# EAGLE schematic rose (EAGLE 7.5.0)

## Sheet 1 of 2
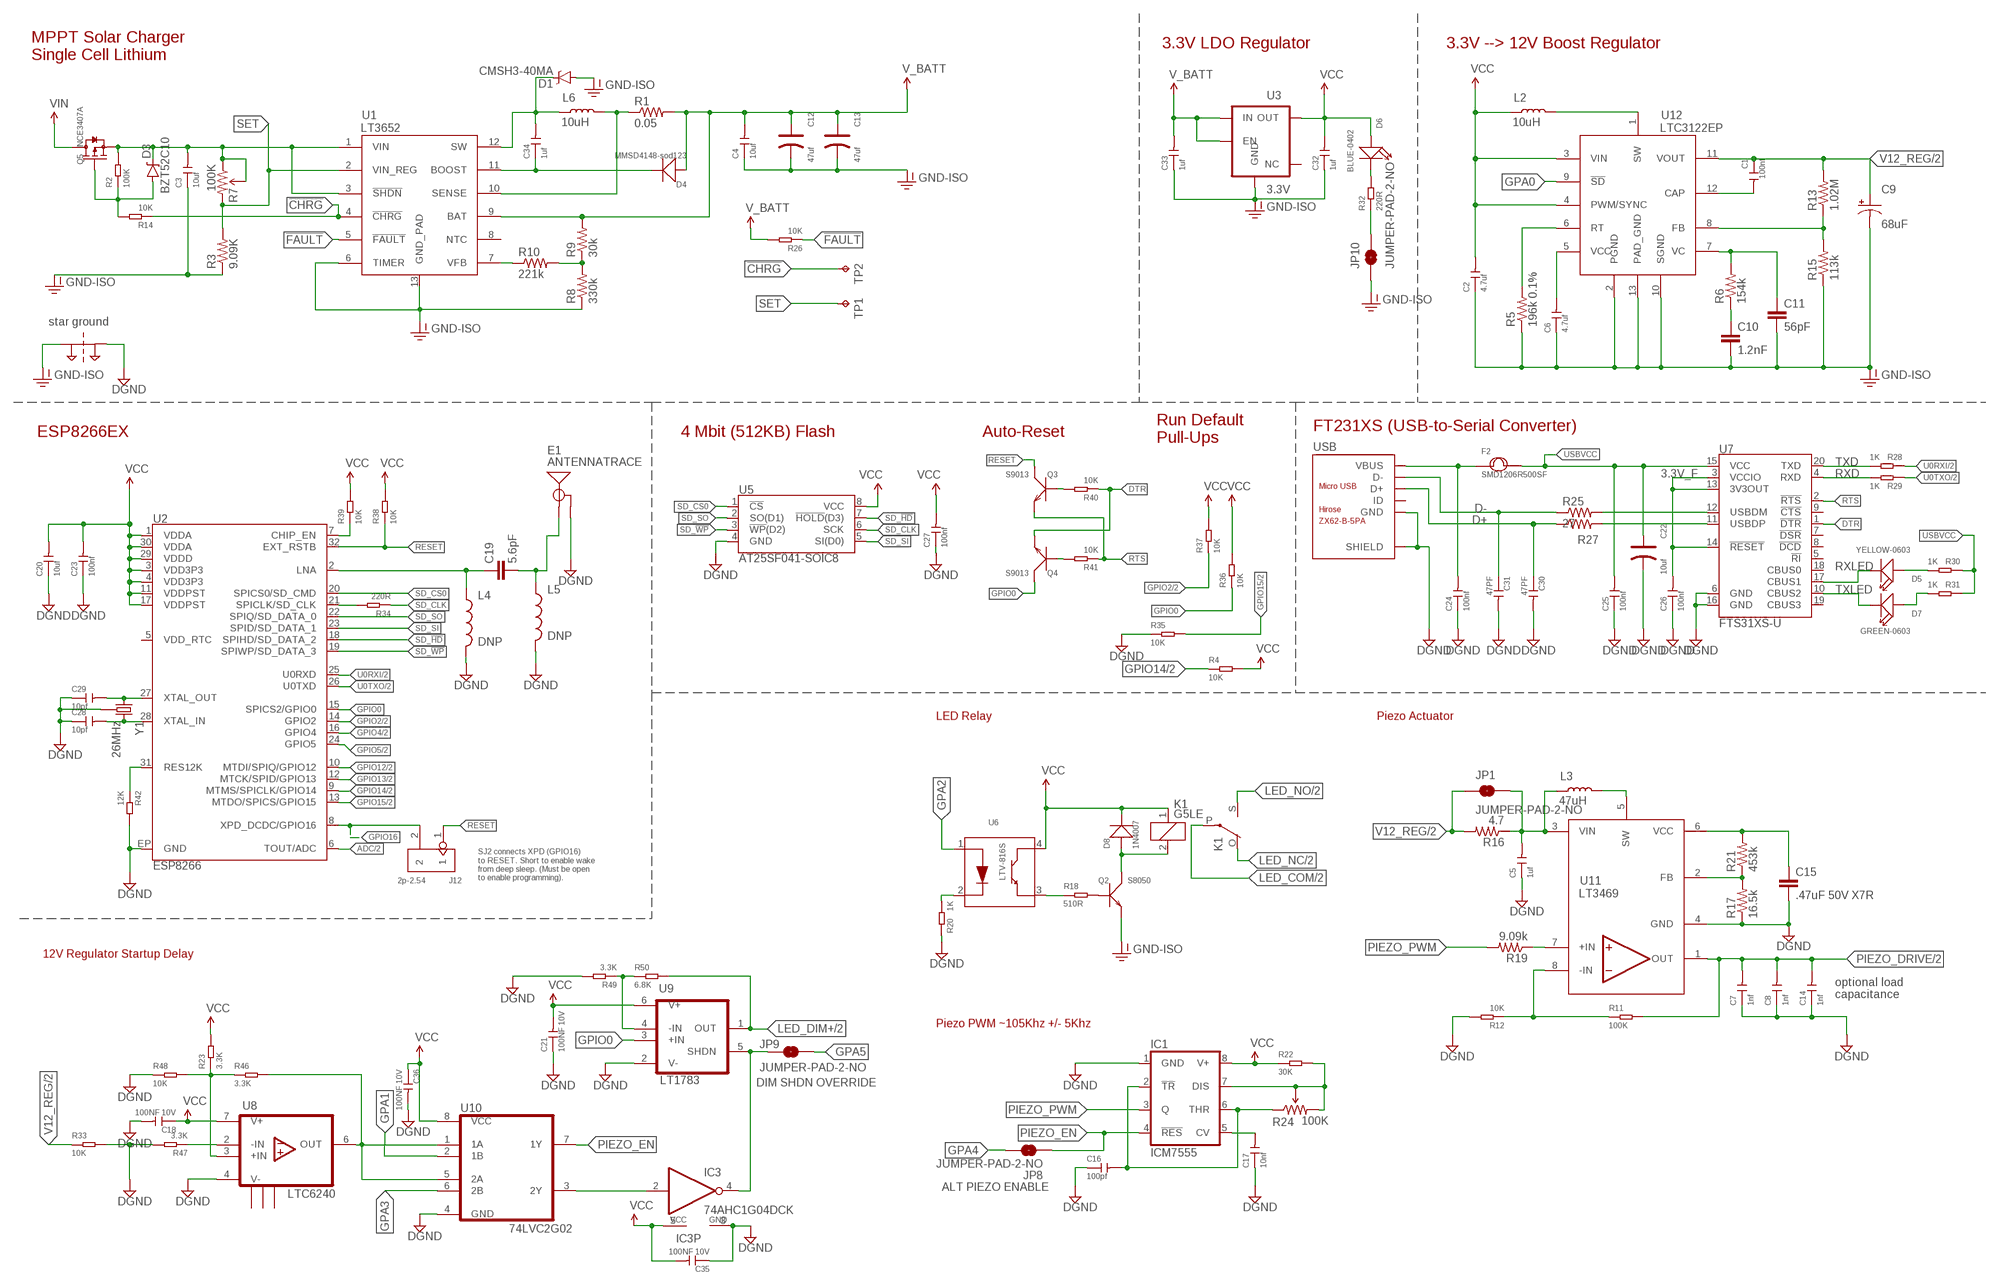
[diagram p0: schematic, sheet 1]

### Parts
C1  100nf  CERAMIC-100NF-25V-10%-X7R(0402)  [C0402]
C2  4.7uf  CERAMIC-4.7UF-10V-10%-X5R(0603)  [C0603]
C3  10uf  CERAMIC-10UF-25V-10%-X5R(0805)  [C0805]
C4  10uf  CERAMIC-10UF-25V-10%-X5R(0805)  [C0805]
C5  1uf  CERAMIC-1UF-25V-10%-X7R(0603)  [C0603]
C6  4.7uf  CERAMIC-4.7UF-10V-10%-X5R(0603)  [C0603]
C7  1nf  CERAMIC-1NF-50V-10%-X7R(0402)  [C0402]
C8  1nf  CERAMIC-1NF-50V-10%-X7R(0402)  [C0402]
C9  68uF  CAP_POL6032  [EIA6032]
C10  1.2nF  CAP0603-CAP  [0603-CAP]
C11  56pF  CAP0603-CAP  [0603-CAP]
C12  47uf  TANTALUM-SMD-47UF-16V(AVX-C)  [AVX-C]
C13  47uf  TANTALUM-SMD-47UF-16V(AVX-C)  [AVX-C]
C14  1nf  CERAMIC-1NF-50V-10%-X7R(0402)  [C0402]
C15  .47uF 50V X7R  CAP0603-CAP  [0603-CAP]
C16  100pf  CERAMIC-100PF-50V-5%-NPO(0603)  [C0603]
C17  10nf  CERAMIC-10NF-50V-10%-X7R(0402)  [C0402]
C18  100NF 10V  CERAMIC 100NF-10V-10%-X5R(0402)  [C0402]
C19  5.6pF  CAP0603-CAP  [0603-CAP]
C20  10uf  CERAMIC-10UF-6.3V-20%-X5R(0402)  [C0402]
C21  100NF 10V  CERAMIC 100NF-10V-10%-X5R(0402)  [C0402]
C22  10uf  TANTALUM-SMD-10UF-10V-10%(AVX-A)  [AVX-A]
C23  100nf  CERAMIC-100NF-25V-10%-X7R(0402)  [C0402]
C24  100nf  CERAMIC-100NF-25V-10%-X7R(0402)  [C0402]
C25  100nf  CERAMIC-100NF-25V-10%-X7R(0402)  [C0402]
C26  100nf  CERAMIC-100NF-25V-10%-X7R(0402)  [C0402]
C27  100nf  CERAMIC-100NF-25V-10%-X7R(0402)  [C0402]
C28  10pf  CERAMIC-10PF-50V-5%-NPO(0402)  [C0402]
C29  10pf  CERAMIC-10PF-50V-5%-NPO(0402)  [C0402]
C30  47PF  CERAMIC-47PF-50V-5%-NP0(0402)  [C0402]
C31  47PF  CERAMIC-47PF-50V-5%-NP0(0402)  [C0402]
C32  1uf  CERAMIC-1UF-25V-10%-X7R(0603)  [C0603]
C33  1uf  CERAMIC-1UF-25V-10%-X7R(0603)  [C0603]
C34  1uf  CERAMIC-1UF-25V-10%-X7R(0603)  [C0603]
C35  100NF 10V  CERAMIC 100NF-10V-10%-X5R(0402)  [C0402]
C36  100NF 10V  CERAMIC 100NF-10V-10%-X5R(0402)  [C0402]
D1  CMSH3-40MA  DIODE-SCHOTTKY-MBRA140  [SMA-DIODE]
D3  BZT52C10  DIODE-ZENER16V  [SOD-123]
D4  MMSD4148-sod123  SMD-DIODE-100V-200MA(SOD-123)  [SOD-123]
D5  YELLOW-0603  SMD-LED-CLEAR-YELLOW(0603)  [LED-0603]
D6  BLUE-0402  SMD-LED-CLEAR-BLUE(0402)  [LED-0402]
D7  GREEN-0603  SMD-LED-CLEAR-GREEN(0603)  [LED-0603]
D8  1N4007  DIODE-GEN-PURPOSE-1KV-1A(DO-214AC)  [DO-214AC]
E1  ANTENNATRACE  [TRACE_ANTENNA_2.4GHZ_25.7MM]
F2  SMD1206R500SF  SMD-PPTC-500MA(1206)  [F1206]
IC1  ICM7555  LM555D  [SO08]
IC3  74AHC1G04DCK  [SC70-5]
J12  2p-2.54  DIP-BLACK-MALE-HEADER-VERT(2P-2.54)  [H2-2.54]
JP1  JUMPER-PAD-2-NO  [PAD-JUMPER-2-NO_NO_SILK]
JP8  JUMPER-PAD-2-NO  [PAD-JUMPER-2-NO_NO_SILK]
JP9  JUMPER-PAD-2-NO  [PAD-JUMPER-2-NO_NO_SILK]
JP10  JUMPER-PAD-2-NO  [PAD-JUMPER-2-NO_NO_SILK]
K1  G5LE  [G5LE]
L2  10uH  SRR1240  [SRR1240]
L3  47uH  SRR1240  [SRR1240]
L4  DNP  INDUCTOR0603  [0603]
L5  DNP  INDUCTOR0603  [0603]
L6  10uH  SRR1240  [SRR1240]
PT1  2PT_GND_TIE  [2PT_GND_TIE]
Q2  S8050  SMD-TRANSISTORS-NPN-25V-500MW-S8050(SOT-23)  [SOT-23]
Q3  S9013  SMD-TRANSISTORS-NPN-25V-500MA-S9013(SOT-23)  [SOT-23]
Q4  S9013  SMD-TRANSISTORS-NPN-25V-500MA-S9013(SOT-23)  [SOT-23]
Q5  NCE3407A  SMD-MOSFET-P-CH-VDC=30V-ID=4.3A-NCE3407A(SOT-23)  [SOT-23]
R1  0.05  RESISTOR1206  [1206]
R2  100K  SMD-RES-100K-1%-1/10W(0603)  [R0603]
R3  9.09K  RESISTOR0603-RES  [0603-RES]
R4  10K  SMD-RES-10K-1%-1/10W(0603)  [R0603]
R5  196k 0.1%  RESISTOR0603-RES  [0603-RES]
R6  154k  RESISTOR0603-RES  [0603-RES]
R7  100K  TRIMPOT-5MMSMD_TRIM_TOP_ADJUST  [ST4ETA]
R8  330k  RESISTOR0603-RES  [0603-RES]
R9  30k  RESISTOR0603-RES  [0603-RES]
R10  221k  RESISTOR0603-RES  [0603-RES]
R11  100K  SMD-RES-100K-1%-1/10W(0603)  [R0603]
R12  10K  SMD-RES-10K-1%-1/10W(0603)  [R0603]
R13  1.02M  RESISTOR0603-RES  [0603-RES]
R14  10K  SMD-RES-10K-1%-1/10W(0603)  [R0603]
R15  113k  RESISTOR0603-RES  [0603-RES]
R16  4.7  RESISTOR0603-RES  [0603-RES]
R17  16.5k  RESISTOR0603-RES  [0603-RES]
R18  510R  SMD-RES-510R-5%-1/10W(0603)  [R0603]
R19  9.09k  RESISTOR0603-RES  [0603-RES]
R20  1K  SMD-RES-1K-1%-1/10W(0603)  [R0603]
R21  453k  RESISTOR0603-RES  [0603-RES]
R22  30K  SMD-RES-30K-1%-1/10W(0603)  [R0603]
R23  3.3K  SMD-RES-3.3K-1%-1/10W(0603)  [R0603]
R24  100K  TRIMPOT-5MMSMD_TRIM_TOP_ADJUST  [ST4ETA]
R25  27  27OHM1/10W1%(0603)0603-RES  [0603-RES]
R26  10K  SMD-RES-10K-1%-1/10W(0603)  [R0603]
R27  27  27OHM1/10W1%(0603)0603-RES  [0603-RES]
R28  1K  SMD-RES-1K-1%-1/10W(0603)  [R0603]
R29  1K  SMD-RES-1K-1%-1/10W(0603)  [R0603]
R30  1K  SMD-RES-1K-1%-1/10W(0603)  [R0603]
R31  1K  SMD-RES-1K-1%-1/10W(0603)  [R0603]
R32  220R  SMD-RES-220R-5%-1/10W(0603)  [R0603]
R33  10K  SMD-RES-10K-1%-1/10W(0603)  [R0603]
R34  220R  SMD-RES-220R-5%-1/10W(0603)  [R0603]
R35  10K  SMD-RES-10K-1%-1/10W(0603)  [R0603]
R36  10K  SMD-RES-10K-1%-1/10W(0603)  [R0603]
R37  10K  SMD-RES-10K-1%-1/10W(0603)  [R0603]
R38  10K  SMD-RES-10K-1%-1/10W(0603)  [R0603]
R39  10K  SMD-RES-10K-1%-1/10W(0603)  [R0603]
R40  10K  SMD-RES-10K-1%-1/10W(0603)  [R0603]
R41  10K  SMD-RES-10K-1%-1/10W(0603)  [R0603]
R42  12K  SMD-RES-12K-1%-1/10W(0603)  [R0603]
R46  3.3K  SMD-RES-3.3K-1%-1/10W(0603)  [R0603]
R47  3.3K  SMD-RES-3.3K-1%-1/10W(0603)  [R0603]
R48  10K  SMD-RES-10K-1%-1/10W(0603)  [R0603]
R49  3.3K  SMD-RES-3.3K-1%-1/10W(0603)  [R0603]
R50  6.8K  SMD-RES-6.8K-1%-1/10W(0603)  [R0603]
TP1  TPTP10SQ  [TP10SQ]
TP2  TPTP10SQ  [TP10SQ]
U1  LT3652  [MSOP-12_GND]
U2  ESP8266  [QFN32]
U3  3.3V  V_REG_AP2112K-3.3V  [SOT23-5]
U5  AT25SF041-SOIC8  [SO08]
U6  LTV-816S  SMD-PHOTOCOUPLER-5KV-LTV-816S(4P-4.6X6.5MM)  [SMD4-2.54-4.6X6.5MM]
U7  FTS31XS-U  FT231XS  [SSOP20_L]
U8  LTC6240  [SOIC-8]
U9  LT1783  [TSOT-23-6]
U10  74LVC2G02  [TSSOP-8]
U11  LT3469  [TSOT-23-8]
U12  LTC3122EP  [12MSOP]
USB  ZX62-B-5PA  MICRO-USB-SMD(ZX62-B-5PA)  [MICRO-USB5+6P-SMD-0.65-AB]
Y1  26MHz  CRYSTAL-GROUNDED3.2X2.5  [CRYSTAL-SMD-3.2X2.5]

### Nets
3.3V_F: C26.2 U7.3(VCCIO) U7.13(3V3OUT) U7.14(!RESET)
!CHRG: R14.1 TP2.TP U1.4(!CHRG)
!FAULT: R26.1 U1.5(!FAULT)
ADC: U2.6(TOUT/ADC) ; also sheet 2
BOOST: C34.1 D4.- U1.11(BOOST)
CHIP_EN: R39.1 U2.7(CHIP_EN)
D+: C30.1 R27.1 USB.3(D+)
D-: C31.1 R25.1 USB.2(D-)
DGND: C5.1 C7.1 C8.1 C14.1 C15.2 C16.1 C17.1 C18.2 C20.1 C21.1 C22.- C23.1 C24.1 C25.1 C26.1 C27.1 C28.1 C29.1 C30.2 C31.2 C35.1 C36.2 E1.GND E1.GND2(GND) IC1.1(GND) IC3.3(GND) L4.2 L5.2 PT1.P$2 R12.2 R17.1 R20.2 R33.2 R35.1 R42.2 R47.2 R48.1 R49.2 U2.EP(GND) U5.4(GND) U7.6(GND) U7.16(GND) U8.4(V-) U9.2(V-) U10.4(GND) U11.4(GND) USB.5(GND) USB.P1(SHIELD) USB.P2(SHIELD) USB.P3(SHIELD) USB.P4(SHIELD) USB.P5(SHIELD) USB.P6(SHIELD) Y1.2(GND) Y1.4(GND) ; also sheet 2
DTR: Q4.2(E) R40.1 U7.1(!DTR)
FB: R8.2 R9.1 R10.2
GND-ISO: C2.1 C3.1 C4.1 C6.1 C9.P$2(-) C10.2 C11.2 C12.- C13.- C32.1 C33.1 D1.A JP10.1 PT1.P$1 Q2.2(E) R3.1 R5.1 R8.1 R15.1 U1.6(TIMER) U1.13(GND_PAD) U3.2(GND) U12.2(PGND) U12.10(SGND) U12.13(PAD_GND) ; also sheet 2
GPA0: U12.9(!SD) ; also sheet 2
GPA1: U10.2(1B) ; also sheet 2
GPA2: U6.1(ANODE) ; also sheet 2
GPA3: U10.6(2B) ; also sheet 2
GPA4: JP8.1 ; also sheet 2
GPA5: JP9.1 ; also sheet 2
GPIO0: Q4.3(C) R36.1 U2.15(SPICS2/GPIO0) U9.3(+IN)
GPIO2: R37.1 U2.14(GPIO2) ; also sheet 2
GPIO4: U2.16(GPIO4) ; also sheet 2
GPIO5: U2.24(GPIO5) ; also sheet 2
GPIO12: U2.10(MTDI/SPIQ/GPIO12) ; also sheet 2
GPIO13: U2.12(MTCK/SPID/GPIO13) ; also sheet 2
GPIO14: R4.1 U2.9(MTMS/SPICLK/GPIO14) ; also sheet 2
GPIO15: R35.2 U2.13(MTDO/SPICS/GPIO15) ; also sheet 2
GPIO16: J12.2 U2.8(XPD_DCDC/GPIO16)
LED_COM: K1.P(2:P) ; also sheet 2
LED_DIM+: R50.2 U9.1(OUT) ; also sheet 2
LED_NC: K1.O(2:O) ; also sheet 2
LED_NO: K1.S(2:S) ; also sheet 2
LNA: C19.1 L4.1 U2.2(LNA)
LNA2: C19.2 E1.ANT(SIGNAL) L5.1
N$1: R42.1 U2.31(RES12K)
N$2: C3.2 D3.C Q5.2(S) R2.2 R7.P$1(CCW) R7.P$2(WIPER) U1.1(VIN) U1.3(!SHDN)
N$3: R10.1 U1.7(VFB)
N$5: R20.1 U6.2(CATHODE)
N$6: D3.A Q5.1(G) R2.1 R14.2
N$7: IC1.7(DIS) R22.2 R24.P$2(WIPER) R24.P$3(CW)
N$8: C28.2 U2.28(XTAL_IN) Y1.3
N$9: D8.1(+) K1.2 Q2.3(C)
N$12: C16.2 IC1.2(!TR) IC1.6(THR) R24.P$1(CCW)
N$13: R18.1 U6.3(EMITER)
N$14: C17.2 IC1.5(CV)
N$15: Q2.1(B) R18.2
N$16: C29.2 U2.27(XTAL_OUT) Y1.1
N$17: L2.P$2 U12.1(SW)
N$18: R5.2 U12.6(RT)
N$19: C6.2 U12.5(VCC)
N$20: R46.2 U8.6(OUT) U10.1(1A) U10.5(2A)
N$21: C1.2 U12.12(CAP)
N$22: C11.1 R6.2 U12.7(VC)
N$23: R13.1 R15.2 U12.8(FB)
N$24: C10.1 R6.1
N$25: L3.P$2 U11.5(SW)
N$26: C5.2 JP1.2 L3.P$1 R16.1 U11.3(VIN)
N$27: R11.1 R12.1 U11.8(-IN)
N$29: R19.1 U11.7(+IN)
N$30: C15.1 R21.2 U11.6(VCC)
N$31: R17.2 R21.1 U11.2(FB)
N$32: D7.+ R31.1
N$33: D5.+ R30.1
N$34: R25.2 U7.12(USBDM)
N$35: R27.2 U7.11(USBDP)
N$36: D6.- R32.2
N$37: JP10.2 R32.1
N$38: Q3.1(B) R40.2
N$39: Q4.1(B) R41.2
N$59: R23.1 R46.1 R48.2 U8.3(+IN)
N$60: R47.1 U8.2(-IN)
N$64: R49.1 R50.1 U9.4(-IN)
N$65: IC3.2(I) U10.3(2Y)
N$67: IC3.4(O) JP9.2 U9.5(SHDN)
PIEZO_DRIVE: C7.2 C8.2 C14.2 R11.2 U11.1(OUT) ; also sheet 2
PIEZO_EN: IC1.4(!RES) JP8.2 U10.7(1Y)
PIEZO_PWM: IC1.3(Q) R19.2
RESET: J12.1 Q3.3(C) R38.1 U2.32(EXT_RSTB)
RTS: Q3.2(E) R41.1 U7.2(!RTS)
RXD: R29.1 U7.4(RXD)
RXLED: D5.- U7.17(CBUS1)
SD_!HD!: U2.18(SPIHD/SD_DATA_2) U5.7(!HOLD!(D3))
SD_!WP!: U2.19(SPIWP/SD_DATA_3) U5.3(!WP!(D2))
SD_CLK: R34.1 U5.6(SCK)
SD_CLK0: R34.2 U2.21(SPICLK/SD_CLK)
SD_CS0: U2.20(SPICS0/SD_CMD) U5.1(!CS!)
SD_SI: U2.23(SPID/SD_DATA_1) U5.5(SI(D0))
SD_SO: U2.22(SPIQ/SD_DATA_0) U5.2(SO(D1))
SENSE: L6.P$2 R1.1 U1.10(SENSE)
SET: R3.2 R7.P$3(CW) TP1.TP U1.2(VIN_REG)
SW: C34.2 D1.C L6.P$1 U1.12(SW)
TXD: R28.1 U7.20(TXD)
TXLED: D7.- U7.10(CBUS2)
U0RXI: R28.2 U2.25(U0RXD) ; also sheet 2
U0TXO: R29.2 U2.26(U0TXD) ; also sheet 2
USBVCC: C22.+ C25.2 F2.2 R30.2 R31.2 U7.15(VCC)
V12_REG: C1.1 C9.P$1(+) JP1.1 R13.2 R16.2 R33.1 U12.11(VOUT) ; also sheet 2
V_BATT: C4.2 C12.+ C13.+ C33.2 D4.+ R1.2 R9.2 R26.2 U1.9(BAT) U3.1(IN) U3.3(EN) ; also sheet 2
VBUS: C24.2 F2.1 USB.1(VBUS)
VCC: C2.2 C18.1 C20.2 C21.2 C23.2 C27.2 C32.2 C35.2 C36.1 D6.+ D8.2(-) IC1.8(V+) IC3.5(VCC) K1.1 L2.P$1 R4.2 R22.1 R23.2 R36.2 R37.2 R38.2 R39.2 U2.1(VDDA) U2.3(VDD3P3) U2.4(VDD3P3) U2.11(VDDPST) U2.17(VDDPST) U2.29(VDDD) U2.30(VDDA) U3.5(OUT) U5.8(VCC) U6.4(COLLECTOR) U8.7(V+) U9.6(V+) U10.8(VCC) U12.3(VIN) U12.4(PWM/SYNC) ; also sheet 2
VIN: Q5.3(D) ; also sheet 2
Unconnected: U1.8(NTC) U2.5(VDD_RTC) U3.4(NC) U7.5(!RI) U7.7(!DSR) U7.8(!DCD) U7.9(!CTS) U7.18(CBUS0) U7.19(CBUS3) U8.1(NC1) U8.5(NC5) U8.8(NC8) USB.4(ID)

### Notes on the sheet
- 3.3V LDO Regulator | 3.3V --> 12V Boost Regulator
- MPPT Solar Charger
  Single Cell Lithium
- star ground
- FT231XS (USB-to-Serial Converter)
- 4 Mbit (512KB) Flash | Auto-Reset
- Run Default
  Pull-Ups
- ESP8266EX
- LED Relay | Piezo Actuator
- SJ2 connects XPD (GPIO16) 
  to RESET. Short to enable wake 
  from deep sleep. (Must be open
  to enable programming).
- 12V Regulator Startup Delay
- optional load
  capacitance
- Piezo PWM ~105Khz +/- 5Khz
- DIM SHDN OVERRIDE
- ALT PIEZO ENABLE

## Sheet 2 of 2
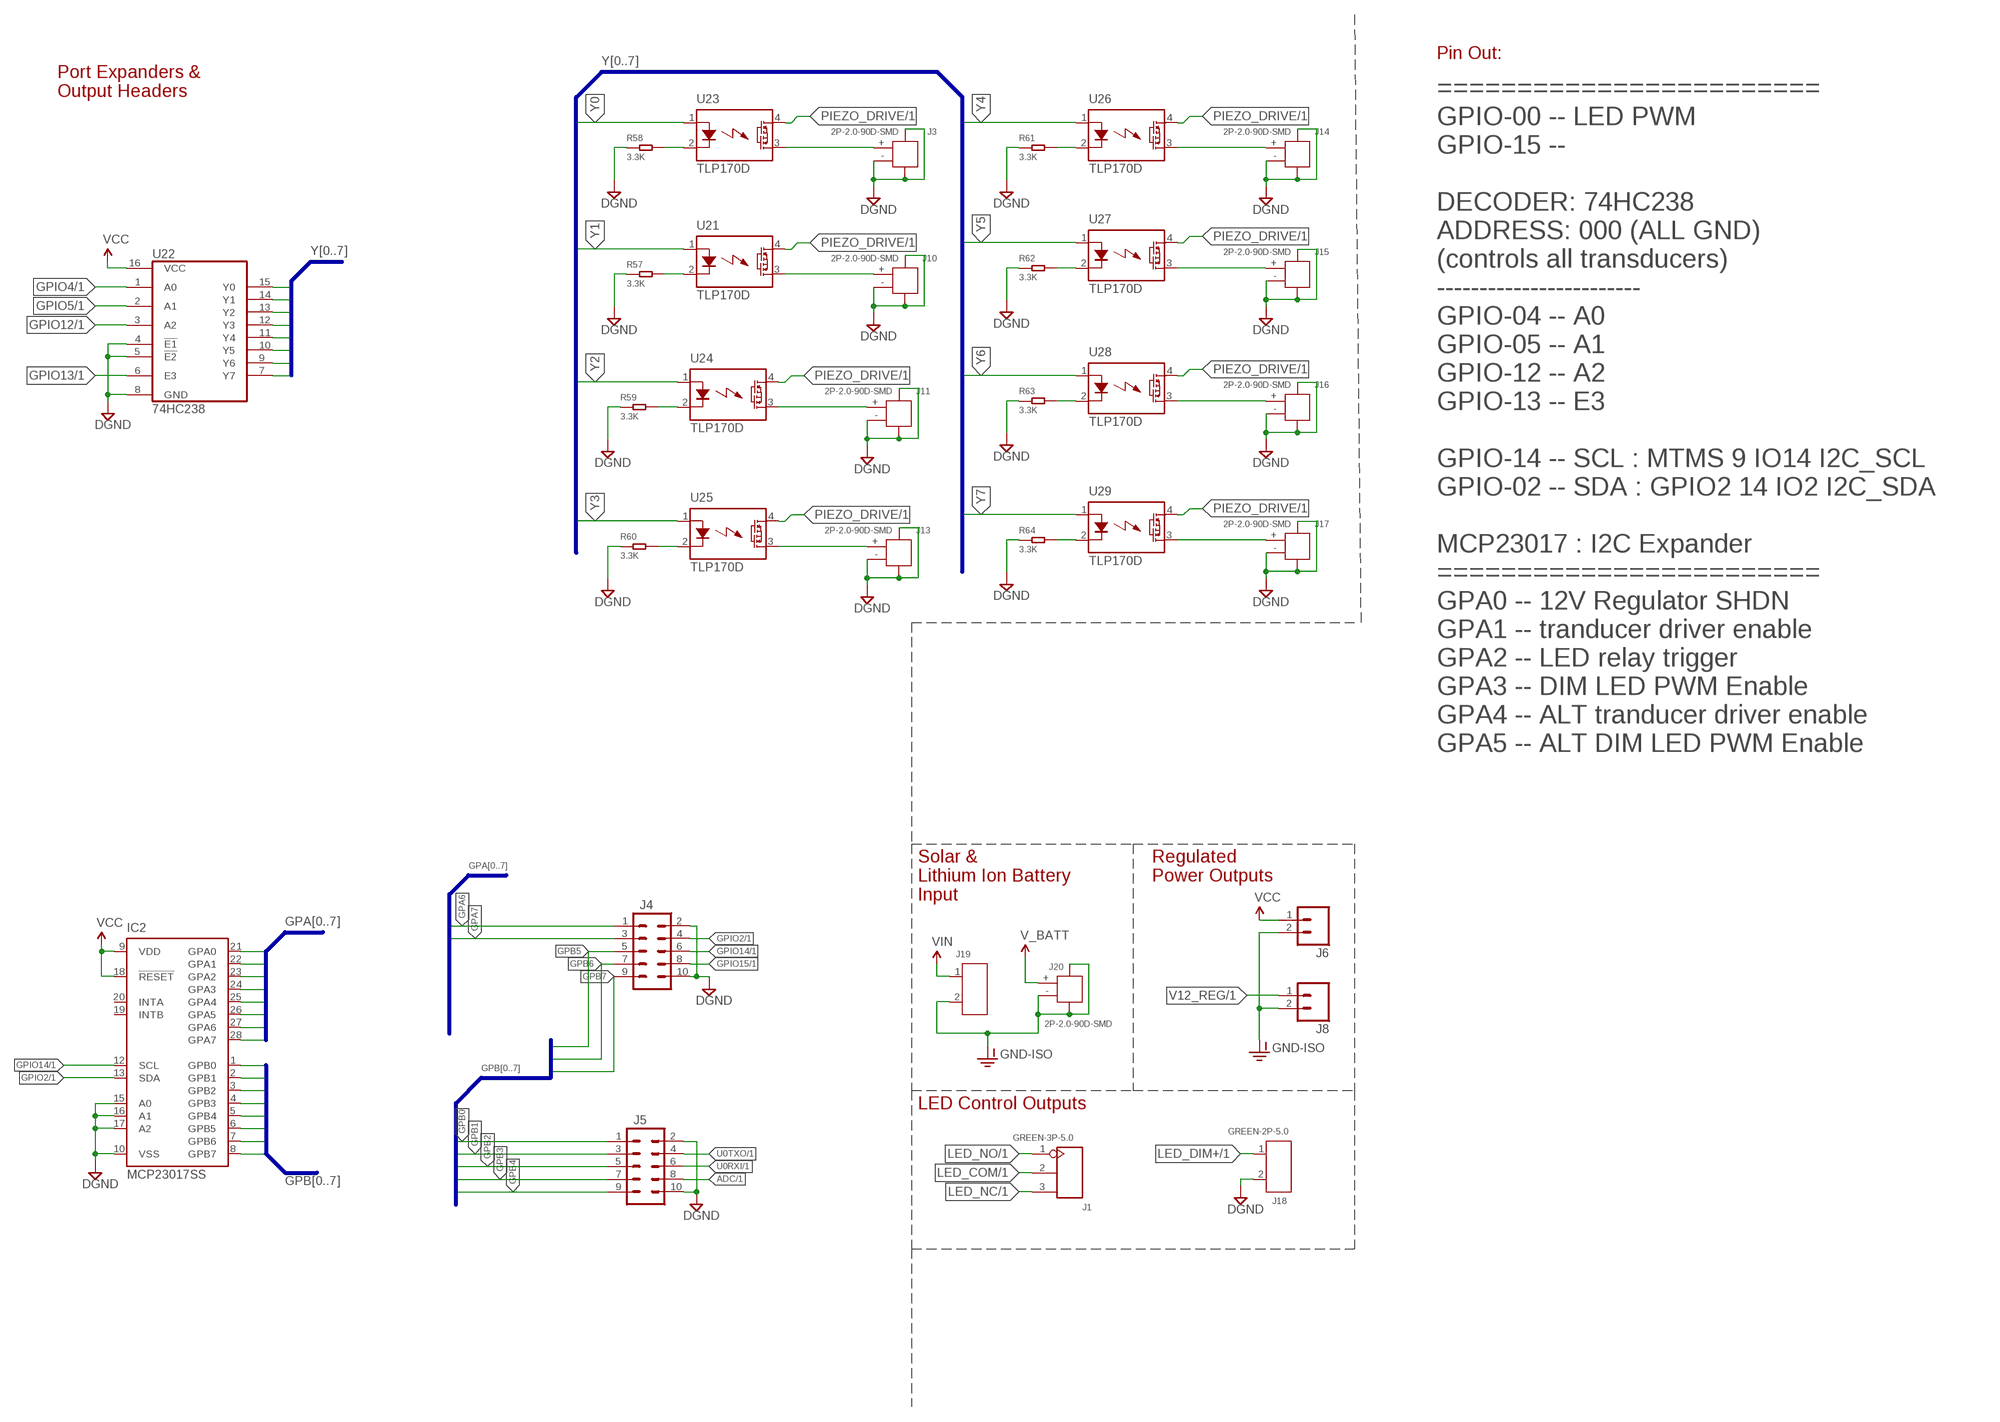
[diagram p1: schematic, sheet 2]

### Parts
IC2  MCP23017SS  [SSOP28]
J1  GREEN-3P-5.0  SCREW-TERMINAL-GREEN(3P-5.0)  [H3-5.0-15.5X8.0MM]
J3  2P-2.0-90D-SMD  CONN-HEADER-SMD-PH-SIDE-(2P-2.0MM)  [HW2-SMD-2.0-90D]
J4  M05X2NO_SILK  [2X5_NOSILK]
J5  M05X2NO_SILK  [2X5_NOSILK]
J6  M02PTH  [1X02]
J8  M02PTH  [1X02]
J10  2P-2.0-90D-SMD  CONN-HEADER-SMD-PH-SIDE-(2P-2.0MM)  [HW2-SMD-2.0-90D]
J11  2P-2.0-90D-SMD  CONN-HEADER-SMD-PH-SIDE-(2P-2.0MM)  [HW2-SMD-2.0-90D]
J13  2P-2.0-90D-SMD  CONN-HEADER-SMD-PH-SIDE-(2P-2.0MM)  [HW2-SMD-2.0-90D]
J14  2P-2.0-90D-SMD  CONN-HEADER-SMD-PH-SIDE-(2P-2.0MM)  [HW2-SMD-2.0-90D]
J15  2P-2.0-90D-SMD  CONN-HEADER-SMD-PH-SIDE-(2P-2.0MM)  [HW2-SMD-2.0-90D]
J16  2P-2.0-90D-SMD  CONN-HEADER-SMD-PH-SIDE-(2P-2.0MM)  [HW2-SMD-2.0-90D]
J17  2P-2.0-90D-SMD  CONN-HEADER-SMD-PH-SIDE-(2P-2.0MM)  [HW2-SMD-2.0-90D]
J18  GREEN-2P-5.0  SCREW-TERMINAL-GREEN(2P-5.0)  [H2-5.0-10.5X8.0MM]
J19  GREEN-2P-5.0  SCREW-TERMINAL-GREEN(2P-5.0)  [H2-5.0-10.5X8.0MM]
J20  2P-2.0-90D-SMD  CONN-HEADER-SMD-PH-SIDE-(2P-2.0MM)  [HW2-SMD-2.0-90D]
R57  3.3K  SMD-RES-3.3K-1%-1/10W(0603)  [R0603]
R58  3.3K  SMD-RES-3.3K-1%-1/10W(0603)  [R0603]
R59  3.3K  SMD-RES-3.3K-1%-1/10W(0603)  [R0603]
R60  3.3K  SMD-RES-3.3K-1%-1/10W(0603)  [R0603]
R61  3.3K  SMD-RES-3.3K-1%-1/10W(0603)  [R0603]
R62  3.3K  SMD-RES-3.3K-1%-1/10W(0603)  [R0603]
R63  3.3K  SMD-RES-3.3K-1%-1/10W(0603)  [R0603]
R64  3.3K  SMD-RES-3.3K-1%-1/10W(0603)  [R0603]
U21  TLP170D  [4-SOP]
U22  74HC238  [TSSOP-16]
U23  TLP170D  [4-SOP]
U24  TLP170D  [4-SOP]
U25  TLP170D  [4-SOP]
U26  TLP170D  [4-SOP]
U27  TLP170D  [4-SOP]
U28  TLP170D  [4-SOP]
U29  TLP170D  [4-SOP]

### Nets
ADC: J5.8 ; also sheet 1
DGND: IC2.10(VSS) IC2.15(A0) IC2.16(A1) IC2.17(A2) J3.3 J3.4 J3.- J4.2 J4.10 J5.2 J5.10 J10.3 J10.4 J10.- J11.3 J11.4 J11.- J13.3 J13.4 J13.- J14.3 J14.4 J14.- J15.3 J15.4 J15.- J16.3 J16.4 J16.- J17.3 J17.4 J17.- J18.2 R57.1 R58.1 R59.1 R60.1 R61.1 R62.1 R63.1 R64.1 U22.4(!E1) U22.5(!E2) U22.8(GND) ; also sheet 1
GND-ISO: J6.2 J8.2 J19.2 J20.3 J20.4 J20.- ; also sheet 1
GPA0: IC2.21(GPA0) ; also sheet 1
GPA1: IC2.22(GPA1) ; also sheet 1
GPA2: IC2.23(GPA2) ; also sheet 1
GPA3: IC2.24(GPA3) ; also sheet 1
GPA4: IC2.25(GPA4) ; also sheet 1
GPA5: IC2.26(GPA5) ; also sheet 1
GPA6: IC2.27(GPA6) J4.1
GPA7: IC2.28(GPA7) J4.3
GPB0: IC2.1(GPB0) J5.1
GPB1: IC2.2(GPB1) J5.3
GPB2: IC2.3(GPB2) J5.5
GPB3: IC2.4(GPB3) J5.7
GPB4: IC2.5(GPB4) J5.9
GPB5: IC2.6(GPB5) J4.5
GPB6: IC2.7(GPB6) J4.7
GPB7: IC2.8(GPB7) J4.9
GPIO2: IC2.13(SDA) J4.4 ; also sheet 1
GPIO4: U22.1(A0) ; also sheet 1
GPIO5: U22.2(A1) ; also sheet 1
GPIO12: U22.3(A2) ; also sheet 1
GPIO13: U22.6(E3) ; also sheet 1
GPIO14: IC2.12(SCL) J4.6 ; also sheet 1
GPIO15: J4.8 ; also sheet 1
LED_COM: J1.2 ; also sheet 1
LED_DIM+: J18.1 ; also sheet 1
LED_NC: J1.3 ; also sheet 1
LED_NO: J1.1 ; also sheet 1
N$10: J10.+ U21.3(DS2)
N$43: R57.2 U21.2(K)
N$45: J11.+ U24.3(DS2)
N$46: R59.2 U24.2(K)
N$47: J3.+ U23.3(DS2)
N$48: R58.2 U23.2(K)
N$49: J13.+ U25.3(DS2)
N$50: R60.2 U25.2(K)
N$51: J14.+ U26.3(DS2)
N$52: R61.2 U26.2(K)
N$53: J15.+ U27.3(DS2)
N$54: R62.2 U27.2(K)
N$55: J16.+ U28.3(DS2)
N$56: R63.2 U28.2(K)
N$57: J17.+ U29.3(DS2)
N$58: R64.2 U29.2(K)
PIEZO_DRIVE: U21.4(DS1) U23.4(DS1) U24.4(DS1) U25.4(DS1) U26.4(DS1) U27.4(DS1) U28.4(DS1) U29.4(DS1) ; also sheet 1
U0RXI: J5.6 ; also sheet 1
U0TXO: J5.4 ; also sheet 1
V12_REG: J8.1 ; also sheet 1
V_BATT: J20.+ ; also sheet 1
VCC: IC2.9(VDD) IC2.18(!RESET) J6.1 U22.16(VCC) ; also sheet 1
VIN: J19.1 ; also sheet 1
Y0: U22.15(Y0) U23.1(A)
Y1: U21.1(A) U22.14(Y1)
Y2: U22.13(Y2) U24.1(A)
Y3: U22.12(Y3) U25.1(A)
Y4: U22.11(Y4) U26.1(A)
Y5: U22.10(Y5) U27.1(A)
Y6: U22.9(Y6) U28.1(A)
Y7: U22.7(Y7) U29.1(A)
Unconnected: IC2.19(INTB) IC2.20(INTA)

### Buses
GPA[0..7]
GPB[0..7]
Y[0..7]

### Notes on the sheet
- Pin Out:
- Port Expanders & 
  Output Headers
- ========================
  GPIO-00 -- LED PWM
  GPIO-15 -- 
  
  DECODER: 74HC238 
  ADDRESS: 000 (ALL GND)
  (controls all transducers)
  ------------------------
  GPIO-04 -- A0
  GPIO-05 -- A1
  GPIO-12 -- A2
  GPIO-13 -- E3 
  
  GPIO-14 -- SCL : MTMS 9 IO14 I2C_SCL
  GPIO-02 -- SDA : GPIO2 14 IO2 I2C_SDA
  
  MCP23017 : I2C Expander
  ========================
  GPA0 -- 12V Regulator SHDN
  GPA1 -- tranducer driver enable
  GPA2 -- LED relay trigger
  GPA3 -- DIM LED PWM Enable
  GPA4 -- ALT tranducer driver enable
  GPA5 -- ALT DIM LED PWM Enable
- Regulated
  Power Outputs
- Solar & 
  Lithium Ion Battery 
  Input
- LED Control Outputs

## Library data of the parts
C1 C23-C27 = Seeed-OPL-Capacitor:CERAMIC-100NF-25V-10%-X7R(0402): 302010024; MPN: CC0402KRX7R8BB104
C2 C6 = Seeed-OPL-Capacitor:CERAMIC-4.7UF-10V-10%-X5R(0603): 302010111; MPN: CC0603KRX5R6BB475
C3 C4 = Seeed-OPL-Capacitor:CERAMIC-10UF-25V-10%-X5R(0805): 302010178; MPN: CC0805KKX5R8BB106
C5 C32-C34 = Seeed-OPL-Capacitor:CERAMIC-1UF-25V-10%-X7R(0603): 302010139; MPN: CC0603KRX7R8BB105
C7 C8 C14 = Seeed-OPL-Capacitor:CERAMIC-1NF-50V-10%-X7R(0402): 302010005; MPN: CC0402KRX7R9BB102
C9 = SparkFun-Capacitors:CAP_POL: Capacitor Polarized These are standard SMD and PTH capacitors. Normally 10uF, 47uF, and 100uF in electrolytic and tantalum varieties. Always verify the external diameter of the through hole cap, it varies with capacity, voltage, and manufacturer. The EIA devices should be standard.
C10 C11 C15 = SparkFun-Capacitors:CAP: Capacitor Standard 0603 ceramic capacitor, and 0.1" leaded capacitor.
C12 C13 = Seeed-OPL-Capacitor:TANTALUM-SMD-47UF-16V(AVX-C): 302020022
C16 = Seeed-OPL-Capacitor:CERAMIC-100PF-50V-5%-NPO(0603): 302010076
C17 = Seeed-OPL-Capacitor:CERAMIC-10NF-50V-10%-X7R(0402): 302010006; MPN: CC0402KRX7R9BB103
C18 C21 C35 C36 = Seeed-OPL-Capacitor:CERAMIC 100NF-10V-10%-X5R(0402): 302010037; MPN: CC0402KRX5R6BB104
C19 = SparkFun-Capacitors:CAP: Capacitor Standard 0603 ceramic capacitor, and 0.1" leaded capacitor.; PROD_ID: CAP-12456
C20 = Seeed-OPL-Capacitor:CERAMIC-10UF-6.3V-20%-X5R(0402): 302010053; MPN: CC0402MRX5R5BB106
C22 = Seeed-OPL-Capacitor:TANTALUM-SMD-10UF-10V-10%(AVX-A): 302020011; MPN: TAJA106K010RNJ
C28 C29 = Seeed-OPL-Capacitor:CERAMIC-10PF-50V-5%-NPO(0402): 302010001
C30 C31 = Seeed-OPL-Capacitor:CERAMIC-47PF-50V-5%-NP0(0402): 302010007
D1 = SparkFun-DiscreteSemi:DIODE-SCHOTTKY: Schottky diodes in SFE's production catalog BAT20J 1A 23V 0.62Vf RB751 120mA 40V 0.37Vf PMEG4005EJ 0.5A 40V 0.42Vf MBRA140 1A 40V 0.5Vf B340A 3A 40V SMA; PROD_ID: DIO-08053; VALUE: MBRA140
D3 = SparkFun-DiscreteSemi:DIODE-ZENER: Zener Diode Production Part - 8199 3.4V Zener Voltage; PROD_ID: DIO-12440; VALUE: 16V
D4 = Seeed-OPL-Diode:SMD-DIODE-100V-200MA(SOD-123): 304010007; MPN: MMSD4148
D5 = Seeed-OPL-Diode:SMD-LED-CLEAR-YELLOW(0603): 304090044; MPN: 19-217-Y5C-AM1N1VY-3T
D6 = Seeed-OPL-Diode:SMD-LED-CLEAR-BLUE(0402): 304090075; MPN: BL-HB337A-AV-TRB
D7 = Seeed-OPL-Diode:SMD-LED-CLEAR-GREEN(0603): 304090043; MPN: 19-217-G7C-AN1P2-3T
D8 = Seeed-OPL-Diode:DIODE-GEN-PURPOSE-1KV-1A(DO-214AC): 304010013; MPN: 1N4007
E1 = SparkFun-RF:ANTENNA: Chip antenna Chip antenna with ground or secondary connection. Common with larger metal RF connectors.
F2 = Seeed-OPL-fuse:SMD-PPTC-500MA(1206): 307010002; MPN: SMD1206R500SF
IC1 = adafruit:*555: TIMER Changed DIP package to have round (not oval) pin pads http://www.ladyada.net/library/pcb/eaglelibrary.html
IC2 = adafruit:MCP23017: http://ww1.microchip.com/downloads/en/DeviceDoc/21952a.pdf Source: http://ww1.microchip.com/downloads/en/DeviceDoc/21952a.pdf
IC3 = 74xx-little-us:74*1G04: INVERTER Gate
J1 = Seeed-OPL-Connector:SCREW-TERMINAL-GREEN(3P-5.0): 320110029
J3 J10 J11 J13-J17 J20 = Seeed-OPL-Connector:CONN-HEADER-SMD-PH-SIDE-(2P-2.0MM): 320110026
J4 J5 = SparkFun-Connectors:M05X2: Header 5x2 Standard 10-pin dual row 0.1" header. Commonly used with AVR-ISP. Use with Spark Fun Electronics SKU: PRT-00778
J6 J8 = SparkFun-Connectors:M02: Standard 2-pin 0.1" header. Use with - straight break away headers ( PRT-00116) - right angle break away headers (PRT-00553) - swiss pins (PRT-00743) - machine pins (PRT-00117) - female headers (PRT-00115) Molex polarized connector foot print use with: PRT-08233 with associated crimp pins and housings. 2.54_SCREWTERM for use with PRT-10571. 3.5mm Screw Terminal footprints for PRT-08084 5mm Screw Terminal footprints for use with PRT-08432
J12 = Seeed-OPL-Connector:DIP-BLACK-MALE-HEADER-VERT(2P-2.54): 320020016; MPN: P125-1102A0BS116A1
J18 J19 = Seeed-OPL-Connector:SCREW-TERMINAL-GREEN(2P-5.0): 320110031
JP1 JP8-JP10 = SparkFun-Passives:JUMPER-PAD-2-NO
K1 = relay:G5LE: RELAY 1 x switch, 10 A/120 V AC, 8 A/30 V DC, Omron; OC_FARNELL: unknown; OC_NEWARK: unknown
L2 L3 L6 = OkOkOkEagleLibraries:SRR1240: SRR1240 Series - Shielded SMD Power Inductors DATASHEET: http://www.bourns.com/docs/Product-Datasheets/SRR1240.pdf; MPN: SRR1240-470M
L4 L5 = SparkFun-Passives:INDUCTOR: Inductors Basic Inductor/Choke - 0603 and 1206. Footprints are not proven and vary greatly between part numbers. INDUCTOR POWER 3.3UH 4.0A SMD 0.197" L x 0.197" W x 0.177" H (5.00mm x 5.00mm x 4.50mm)
PT1 = SparkFun-Passives:2PT_GND_TIE: Package for connecting two ground nets in one place.
Q2 = Seeed-OPL-Transistor:SMD-TRANSISTORS-NPN-25V-500MW-S8050(SOT-23): 305010017; MPN: S8050
Q3 Q4 = Seeed-OPL-Transistor:SMD-TRANSISTORS-NPN-25V-500MA-S9013(SOT-23): 305010018; MPN: S9013
Q5 = Seeed-OPL-Transistor:SMD-MOSFET-P-CH-VDC=30V-ID=4.3A-NCE3407A(SOT-23): 305030010; MPN: NCE3407A
R1 R3 R5 R6 R8-R10 R13 R15-R17 R19 R21 = SparkFun-Resistors:RESISTOR: Resistor Basic schematic elements and footprints for 0603, 1206, and PTH resistors.
R2 R11 = Seeed-OPL-Resistor:SMD-RES-100K-1%-1/10W(0603): 301010196; MPN: RC0603FR-07100KL
R4 R12 R14 R26 R33 R35-R41 R48 = Seeed-OPL-Resistor:SMD-RES-10K-1%-1/10W(0603): 301010299; MPN: RC0603FR-0710KL
R7 R24 = OkOkOkEagleLibraries:TRIMPOT-5MM: Copal 5MM Trimpot (top adjust) ST4-EA foot print http://www.nidec-copal-electronics.com/e/product/files/file/65e3e77c541ac3708ffab78898d80fdd53dcbd6a.pdf; MPN: ST4ETA104
R18 = Seeed-OPL-Resistor:SMD-RES-510R-5%-1/10W(0603): 301010157; MPN: RC0603JR-07510RL
R20 R28-R31 = Seeed-OPL-Resistor:SMD-RES-1K-1%-1/10W(0603): 301010298; MPN: RC0603FR-071KL
R22 = Seeed-OPL-Resistor:SMD-RES-30K-1%-1/10W(0603): 301010202; MPN: RC0603FR-0730KL
R23 R46 R47 R49 R57-R64 = Seeed-OPL-Resistor:SMD-RES-3.3K-1%-1/10W(0603): 301010251; MPN: RC0603FR-073K3L
R25 R27 = SparkFun-Resistors:27OHM1/10W1%(0603): RES-09334; PROD_ID: RES-09334
R32 R34 = Seeed-OPL-Resistor:SMD-RES-220R-5%-1/10W(0603): 301010163; MPN: RC0603JR-07220RL
R42 = Seeed-OPL-Resistor:SMD-RES-12K-1%-1/10W(0603): 301010102; MPN: RC0603FR-0712KL
R50 = Seeed-OPL-Resistor:SMD-RES-6.8K-1%-1/10W(0603): 301010198; MPN: RC0805JR-07220KL
TP1 TP2 = testpad:TP: Test pad
U1 = SparkFun-PowerIC:LT3652: LT3652 MPPT Solar Charge Controller 5V-32V smart charger for batteries up to 14.4V
U2 = esp8266-development-board:ESP8266: Espressif ESP8266 WiFi Smart Connectivity Platform.; PROD_ID: IC-12452
U3 = SparkFun-PowerIC:V_REG_AP2112: AP2112 - 600mA CMOS LDO Regulator w/ Enable The AP2112 is CMOS process low dropout linear regulator with enable function, the regulator delivers a guaranteed 600mA (min.) continuous load current. Features Output Voltage Accuracy: ±1.5% Output Current: 600mA (Min.) Foldback Short Current Protection: 50mA Enable Function to Turn ON/OFF VOUT Low Dropout Voltage (3.3V): 250mV (Typ.) @IOUT=600mA Excellent Load Regulation: 0.2%/A (Typ.) Excellent Line Regulation: 0.02%/V (Typ.) Low Quiescent Current: 55μA (Typ.) Low Standby Current: 0.01μA (Typ.) Low Output Noise: 50μVRMS PSRR: 100Hz -65dB, 1kHz -65dB OTSD Protection Stable with 1.0μF Flexible Cap: Ceramic, Tantalum and Aluminum Electrolytic Operation Temperature Range: -40°C to 85°C ESD: MM 400V, HBM 4000V; PROD_ID: VREG-12457
U5 = esp8266-development-board:AT25SF041: SPI Serial Flash Memory with Dual/Quad-IO Support Example: Adesto Technologies AT25SF041-SSHD-T (1265-1131-1-ND) <http://www.digikey.com/product-detail/en/AT25SF041-SSHD-T/1265-1131-1-ND/4824165>; PROD_ID: IC-12455
U6 = Seeed-OPL-Transistor:SMD-PHOTOCOUPLER-5KV-LTV-816S(4P-4.6X6.5MM): 306060007; MPN: LTV-816S
U7 = SparkFun-DigitalIC:FT231X: FTDI FT231X Full Speed USB to Full-handshake UART This USB2.0 Full Speed IC offers a compact bridge to full handshake UART interfaces. The device is a UART, capable of operating up to 3MBaud, with low power consumption (8mA). The FT231X includes the complete FT-X series feature set and enables USB to be added into a system design quickly and easily over a UART interface.; PROD_ID: IC-11524
U8 = OkOkOkEagleLibraries:LTC6240: DATASHEET: http://cds.linear.com/docs/en/datasheet/624012fe.pdf The LTC®6240/6241/LTC6242 are single, dual and quad low noise, low offset, rail-to-rail output, unity gain stable CMOS op amps that feature 1pA of input bias current. Input bias current is guaranteed to be 1pA max on the single LTC6240. The 0.1Hz to 10Hz noise of only 550nVP-P, along with an offset of just 125μV are signifi cant improvements over traditional CMOS op amps. Additionally, noise is guaranteed to be less than 10nV/√Hz at 1kHz. An 18MHz gain bandwidth, and 10V/μs slew rate, along with the wide supply range and low input capacitance, make them perfect for use as fast signal processing amplifi ers.; MPN: LTC6240CS8#PBF
U9 = OkOkOkEagleLibraries:LT1783: 1.25MHz, Over-The-Top Micropower, Rail-to-Rail Input and Output Op Amp in SOT-23 DATASHEET: http://cds.linear.com/docs/en/datasheet/1783fd.pdf MFN:LT1783CS6#TRMPBF; MPN: LT1783CS6#TRMPBF
U10 = OkOkOkEagleLibraries:74LVC2G02: The 74LVC2G02 provides a 2-input NOR gate function. Inputs can be driven from either 3.3 V or 5 V devices. This feature allows the use of these devices as translators in a mixed 3.3 V and 5 V environment. This device is fully specified for partial power-down applications using IOFF. The IOFF circuitry disables the output, preventing a damaging backflow current through the device when it is powered down. DATASHEET: http://www.nxp.com/documents/data_sheet/74LVC2G02.pdf MFN: 74LVC2G02DP,125; MPN: 74LVC2G02DP,125
U11 = OkOkOkEagleLibraries:LT3469: LT3469 DATASHEET: http://cds.linear.com/docs/en/datasheet/3469f.pdf The LT® 3469 is a transconductance (gm) amplifier that can drive outputs up to 33V from a 5V or 12V supply. An internal switching regulator generates a boosted supply voltage for the gm amplifier. The amplifier can drive capacitive loads in the range of 5nF to 300nF. Slew rate is limited only by the maximum output current. The 35V output voltage capability of the switching regulator, along with the high supply voltage of the amplifier, combine to allow the wide output voltage range needed to drive a piezoceramic microactuator; MPN: LT3469ETS8#TRMPBF
U12 = OkOkOkEagleLibraries:LTC3122: LTC3122 DATASHEET:http://cds.linear.com/docs/en/datasheet/3122fa.pdf The LTC®3122 is a synchronous step-up DC/DC converter with true output disconnect and inrush current limiting. The 2.5A current limit along with the ability to program output voltages up to 15V makes the LTC3122 well suited for a variety of demanding applications. Once started, operation will continue with inputs down to 500mV, extending runtime in many applications.; MPN: LTC3122EMSE#PBF
U21 U23-U29 = OkOkOkEagleLibraries:TLP170D: The Toshiba TLP170D consists of a gallium arsenide infrared emitting diode optically coupled to a photo-MOSFET in a 4-pin SOP package. This photorelay requires 1 mA of LED current to turn it on. It is suitable for applications that need electrical power saving. DATASHEET: http://www.semicon.toshiba.co.jp/info/docget.jsp?type=datasheet&lang=en&pid=TLP170D MFN: TLP170D(F); MPN: TLP170D(F)
U22 = OkOkOkEagleLibraries:74HC238: High-Speed CMOS Logic 3- to 8-Line Noninverting Decoder/Demultiplexer DATASHEET: http://www.ti.com/lit/ds/symlink/cd74hc138.pdf MPN: CD74HC238PWR; MPN: CD74HC238PWR
USB = Seeed-OPL-Connector:MICRO-USB-SMD(ZX62-B-5PA): 320010005; MPN: ZX62-B-5PA
Y1 = things:CRYSTAL-GROUNDED; PROD_ID: XTAL-12454